# Altium schematic sheet LOGIC.SchDoc
size A4; SheetNumber: 1; SheetTotal: 2
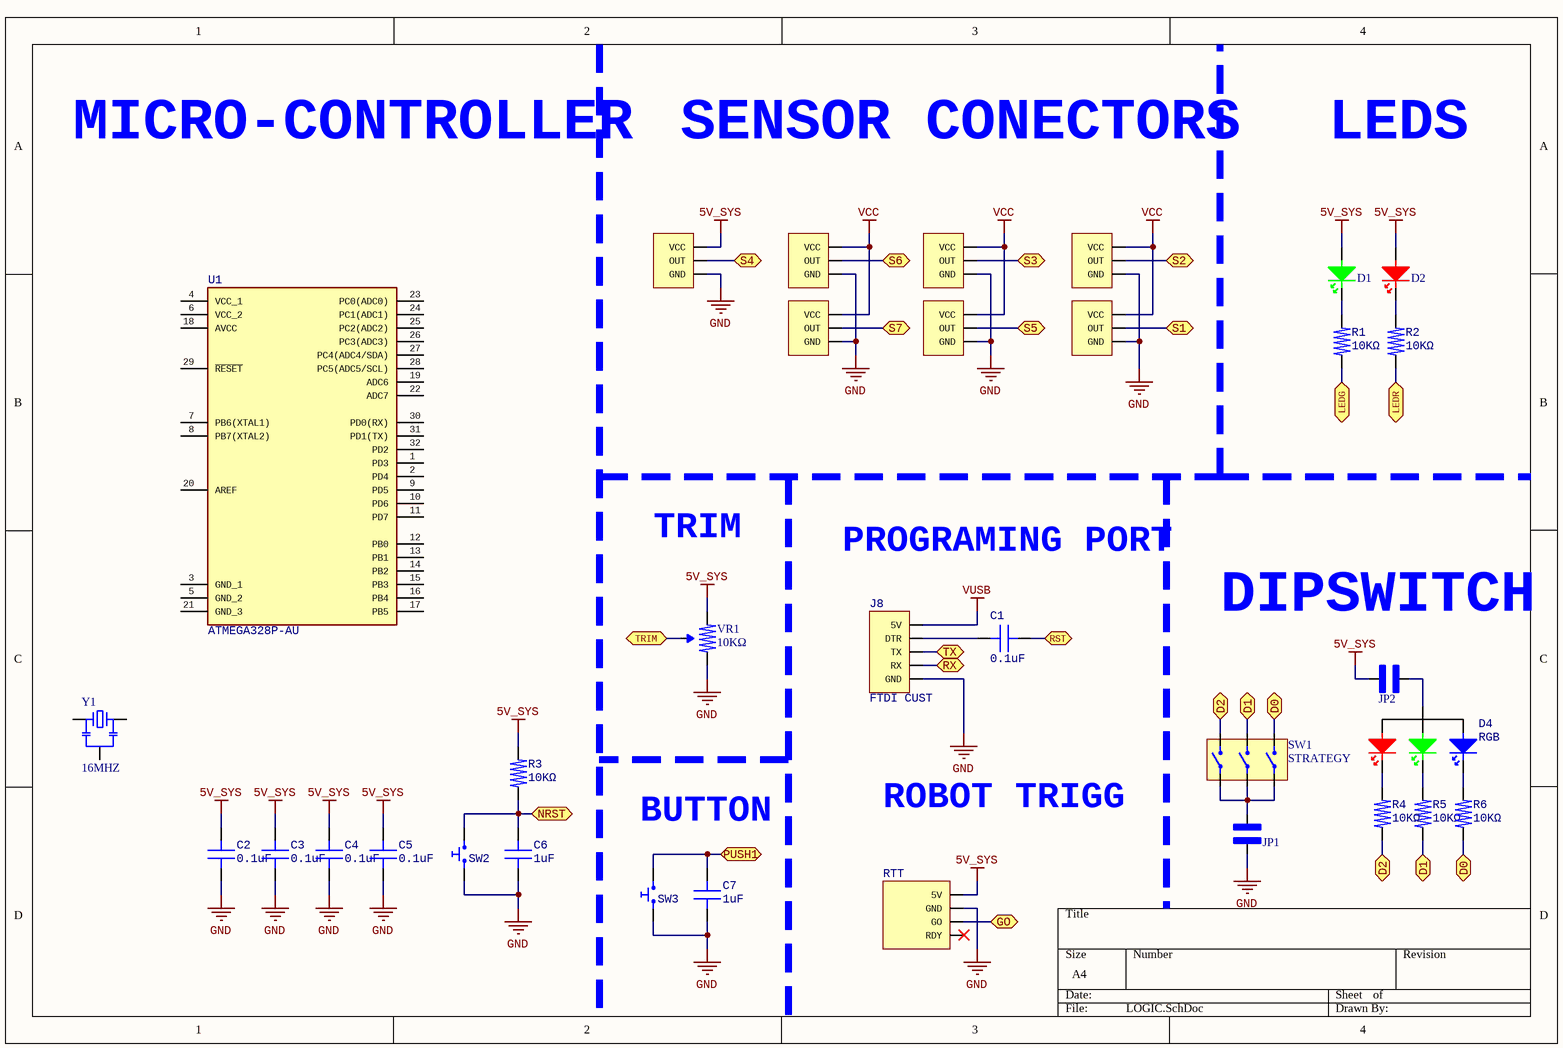
[diagram p0: LOGIC.SchDoc]

## Parts
C1  0.1uF  [CAP0603]
C2  0.1uF  [CAP0603]
C3  0.1uF  [CAP0603]
C4  0.1uF  [CAP0603]
C5  0.1uF  [CAP0603]
C6  1uF  [CAP0603]
C7  1uF  [CAP0603]
D1  G  [LED0603 GREEN]  (value not drawn)
D2  R  [LED0603 RED]  (value not drawn)
D4  RGB  [LED RGB FM-B2020RGBA-HG]
J1  GENERIC SENSOR 3X  [PINHEADER SENSOR CONNECTOR 3X]  (value not drawn)
J2  GENERIC SENSOR 3X  [PINHEADER SENSOR CONNECTOR 3X]  (value not drawn)
J3  GENERIC SENSOR 3X  [PINHEADER SENSOR CONNECTOR 3X]  (value not drawn)
J4  GENERIC SENSOR 3X  [PINHEADER SENSOR CONNECTOR 3X]  (value not drawn)
J5  GENERIC SENSOR 3X  [PINHEADER SENSOR CONNECTOR 3X]  (value not drawn)
J6  GENERIC SENSOR 3X  [PINHEADER SENSOR CONNECTOR 3X]  (value not drawn)
J7  GENERIC SENSOR 3X  [PINHEADER SENSOR CONNECTOR 3X]  (value not drawn)
J8  FTDI CUST  [UART PROG CONN]
J9  RTT  [ING. MAKER RTT]
JP1  ENABLE DPSW  [JUMPER 2 PADS]  (value not drawn)
JP2  ENABLE RGB  [JUMPER 2 PADS]  (value not drawn)
R1  10KΩ  [RES0603]
R2  10KΩ  [RES0603]
R3  10KΩ  [RES0603]
R4  10KΩ  [RES0603]
R5  10KΩ  [RES0603]
R6  10KΩ  [RES0603]
SW1  STRATEGY  [2193MSTR]
SW2  RESET  [PTS810SJK250SMTRLFS]  (value not drawn)
SW3  BUTTON1  [PTS810SJK250SMTRLFS]  (value not drawn)
U1  ATMEGA328P-AU  [TQFP-32]
VR1  10KΩ  [TC33X2503E]
Y1  16MHZ  [CSTCE16M0V53R0]

## Ports
D0 (bidir), D1 (bidir), D2 (bidir), GO (bidir), LEDG (bidir), LEDR (bidir), NRST (bidir), PUSH1 (bidir), RST (bidir), RX (bidir), S1 (bidir), S2 (bidir), S3 (bidir), S4 (bidir), S5 (bidir), S6 (bidir), S7 (bidir), TRIM (bidir), TX (bidir)

## Nets
5V_SYS: C2.2(A) C3.2(A) C4.2(A) C5.2(A) D1.2(A) D2.2(A) J1.2(VCC) J9.1(5V) JP2.C R3.2(A) VR1.3(CW)
GND: C2.1(K) C3.1(K) C4.1(K) C5.1(K) C6.1(K) C7.1(K) J1.4(GND) J2.4(GND) J3.4(GND) J4.4(GND) J5.4(GND) J6.4(GND) J7.4(GND) J8.GND J9.2(GND) JP1.C SW2.1(NO_1) SW3.1(NO_1) VR1.1(CCW)
VCC: J2.2(VCC) J3.2(VCC) J4.2(VCC) J5.2(VCC) J6.2(VCC) J7.2(VCC)
VUSB: J8.5V
D0: R6.1(K) SW1.4(NO_2) ; port D0
D1: R5.1(K) SW1.5(NO_2) ; port D1
D2: R4.1(K) SW1.6(NO_2) ; port D2
GO: J9.3(GO) ; port GO
LEDG: R1.1(K) ; port LEDG
LEDR: R2.1(K) ; port LEDR
NRST: C6.2(A) R3.1(K) SW2.2(NO_2) ; port NRST
PUSH1: C7.2(A) SW3.2(NO_2) ; port PUSH1
RST: C1.1(K) ; port RST
RX: J8.RX ; port RX
S1: J4.3(OUT) ; port S1
S2: J3.3(OUT) ; port S2
S3: J7.3(OUT) ; port S3
S4: J1.3(OUT) ; port S4
S5: J5.3(OUT) ; port S5
S6: J2.3(OUT) ; port S6
S7: J6.3(OUT) ; port S7
TRIM: VR1.2(WIPER) ; port TRIM
TX: J8.TX ; port TX
NetC1_2: C1.2(A) J8.DTR
NetD1_1: D1.1(K) R1.2(A)
NetD2_1: D2.1(K) R2.2(A)
NetD4_1: D4.1(K) R4.2(A)
NetD4_2: D4.2(K) R6.2(A)
NetD4_3: D4.3(COM) JP2.A
NetD4_4: D4.4(K) R5.2(A)
NetJP1_A: JP1.A SW1.1(NO_1) SW1.2(NO_1) SW1.3(NO_1)

Not connected (* = marked no-connect by the designer): J9 4(RDY)*; U1 1(PD3) 2(PD4) 3(GND_1) 4(VCC_1) 5(GND_2) 6(VCC_2) 7(PB6(XTAL1)) 8(PB7(XTAL2)) 9(PD5) 10(PD6) 11(PD7) 12(PB0) 13(PB1) 14(PB2) 15(PB3) 16(PB4) 17(PB5) 18(AVCC) 19(ADC6) 20(AREF) 21(GND_3) 22(ADC7) 23(PC0(ADC0)) 24(PC1(ADC1)) 25(PC2(ADC2)) 26(PC3(ADC3)) 27(PC4(ADC4/SDA)) 28(PC5(ADC5/SCL)) 29(~{RESET}) 30(PD0(RX)) 31(PD1(TX)) 32(PD2); Y1 1 3 4

## Notes on the sheet
- MICRO-CONTROLLER
- SENSOR CONECTORS
- LEDS
- TRIM
- PROGRAMING PORT
- DIPSWITCH
- BUTTON
- ROBOT TRIGG

## Library data of the parts
C1-C5 = C0.1uF 25V X7R: Capacitor, Multilayer, Ceramic, 25V, 10%, X7R, 15% Tc, 0.1Uf, Surface Mount, 0603; Manufacturer: KEMET; Manufacturer Part Number: C0603C104K3RACTU; Material: 4241ConductorMaterial; Capacitance: 100nF; Dissipation Factor: 3.5%; Temperature Coefficient: 30ppm/°C; Supplier 1: Mouser; RoHS: Yes; Category: Ceramic Capacitors; Stock 1: 364631; Pricing 1: 1=0.19, 10=0.12, 50=0.12, 100=0.062, 1000=0.041, 10000=0.024 (USD); Mount: Surface Mount,PCB; Case/Package: 0603; Number of Pins: 2; Case Code (Metric): 1608; Case Code (Imperial): 0603; Dielectric Material: Ceramic; Min Operating Temperature: -55°C; Max Operating Temperature: 125°C; Dielectric: X7R; Package Quantity: 1; Voltage Rating: 25V; Tolerance: 10%; Packaging: Tape and Reel; Voltage Rating (DC): 25V; Termination: SMD/SMT; Voltage: 25V; Series: C; Construction: Flat; Length: 1.6mm; Width: 0.031inch; Height: 0.8mm; Thickness: 0.034inch; Lead Pitch: 0.7mm; Depth: 0.8mm; Radiation Hardening: No; Reach SVHC Compliant: No; RoHS Compliant: Yes; Lead Free: 5697LeadFree
C6 C7 = C1uF 50V X5R: Multilayer Ceramic Capacitor, 1 uF, 50 V, ï¿½ 10%, X5R, 0603 [1608 Metric]; Manufacturer: TDK; Manufacturer Part Number: C1608X5R1H105K080AB; Dielectric Material: 4241ConductorMaterial; Voltage Rating: 50V; Supplier 1: Mouser; RoHS: Yes; Category: Ceramic Capacitors; Stock 1: 142150; Pricing 1: 1=0.14, 10=0.078, 50=0.078, 100=0.05, 1000=0.035, 10000=0.023 (USD); Mount: Surface Mount; Case/Package: 0603; Number of Pins: 2; Case Code (Metric): 1608; Case Code (Imperial): 0603; Material: Ceramic; Min Operating Temperature: -55°C; Max Operating Temperature: 85°C; Capacitance: 1uF; Tolerance: 10%; Packaging: Tape and Reel; Package Quantity: 1; Dielectric: X5R; Voltage: 50V; Series: C; Construction: Flat; Length: 1.6mm; Width: 0.031inch; Height: 0.8mm; Thickness: 0.035inch; Depth: 0.8mm; Reach SVHC Compliant: No; Lead Free: Lead Free; RoHS Compliant: Yes
D1 = GREEN LED 0603: WURTH ELEKTRONIK - 150060VS75000 - LED, Green, SMD, 0603, 30 mA, 2 V, 570 nm; Manufacturer: Wurth Electronics; Lens Color: Colorless; Luminous Intensity: 40mcd; Viewing Angle: 140°; Forward Voltage: 2V; Lens Style: Rectangular,Flat; Forward Current: 20mA; Dominant Wavelength: 570nm; Lens Transparency: Clear; Power Rating: 72mW; Reverse Voltage (DC): 5V; Lens Size: 0.7mm; Supplier 1: Mouser; Manufacturer Part Number: 150060VS75000; RoHS: Yes; Category: LEDs; Stock 1: 15118; Pricing 1: 1=0.14, 10=0.14, 50=0.127, 100=0.109, 1000=0.101, 10000=0.101 (USD); Mount: Surface Mount; Case/Package: 0603; Number of Pins: 2; Color: Green; Case Code (Metric): 1608; Case Code (Imperial): 0603; Weight: 0.000882oz; Min Operating Temperature: -40°C; Max Operating Temperature: 85°C; Package Quantity: 4000; Packaging: Cut Tape; Test Current: 20mA; Illumination Color: Green; Series: WL-SMCW; Max Reverse Voltage (DC): 5V; Power Dissipation: 72mW; Reverse Voltage: 5V; Length: 1.6mm; Width: 0.8mm; Height: 0.8mm; RoHS Compliant: Yes; Reach SVHC Compliant: Unknown
D2 = RED LED 0603: Led, Red, 630 Nm, 1.9 V, 30 Ma, 60 Mcd Rohs Compliant: Yes |Wurth Elektronik 150060SS75000; Manufacturer: Wurth Electronics; Lens Color: Colorless; Luminous Intensity: 60mcd; Viewing Angle: 140°; Forward Voltage: 1.9V; Wavelength: 630nm; Lens Style: Clear,Flat,Rectangular; Forward Current: 30mA; Test Current: 20mA; Lens Transparency: Clear; Max Reverse Voltage (DC): 5V; Lens Size: 0.7mm; Supplier 1: Mouser; Manufacturer Part Number: 150060SS75000; RoHS: Yes; Category: LEDs; Stock 1: 8814; Pricing 1: 1=0.15, 10=0.15, 50=0.142, 100=0.122, 1000=0.116, 10000=0.116 (USD); Mount: Surface Mount; Case/Package: 0603; Color: Red; Case Code (Metric): 1608; Case Code (Imperial): 0603; Min Operating Temperature: -40°C; Max Operating Temperature: 85°C; Package Quantity: 1; Packaging: Cut Tape; Dominant Wavelength: 630nm; Series: WL-SMCW; Length: 1.6mm; Width: 0.8mm; Height: 0.8mm; RoHS Compliant: Yes; Reach SVHC Compliant: Unknown
D4 = RGB LED FM-B2020RGBA-HG: LED RGB
J1-J7 = GENERIC SENSOR 3X: PADS PARA CONECTAR UN SENSOR CON 1 LINEA DE VOLTAJE INDEPENDIENTE.
J8 = UART PROG: GENERIC UART PROGRAMING PORT FOR ARDUINO CUSTOM BOARDS
J9 = ING. MAKER RTT: CONECTOR PINHEADER PARA ARRANCADPR ING. MAKER
JP1 JP2 = SINGLE JUMPER NO: JUMPER SMD CON 2 PADS NORMALMENTE ABIERTO; pin to pad: A>2 C>1
R1 R2 R4-R6 = R1KΩ: SMD Chip Resistor, 1 kOhm, ï¿½ 1%, 100 mW, 0603 [1608 Metric], Thick Film, General Purpose; Manufacturer: Yageo; Manufacturer Part Number: RC0603FR-101KL; Resistance: 1kR; Temperature Coefficient: 100ppm/°C; Power Rating: 100mW; Voltage Rating: 50V; Supplier 1: Mouser; RoHS: Yes; Category: Chip SMD Resistors; Stock 1: 45082; Pricing 1: 1=0.1, 10=0.01, 50=0.01, 100=0.007, 1000=0.005, 10000=0.002 (USD); Case/Package: 0603; Number of Pins: 2; Contact Plating: Tin,Lead; Case Code (Imperial): 0603; Case Code (Metric): 1608; Min Operating Temperature: -55°C; Max Operating Temperature: 155°C; Tolerance: 1%; Resistor Type: Thick Film; Packaging: Tape and Reel; Termination: SMD/SMT; Voltage Rating (DC): 50V; Series: RC; Resistance Tolerance: 1%; Length: 1.6mm; Width: 0.8mm; Height: 0.45mm; RoHS Compliant: Yes; Reach SVHC Compliant: Unknown
R3 = R10KΩ: SMD Chip Resistor, 10 kOhm, ï¿½ 5%, 100 mW, 0603 [1608 Metric], Thick Film, General Purpose; Manufacturer: Yageo; Manufacturer Part Number: RC0603JR-0710KL; Resistance: 10kR; Temperature Coefficient: 100ppm/°C; Max Power Dissipation: 100mW; Voltage Rating (AC): 50V; Supplier 1: Mouser; RoHS: Yes; Category: Chip SMD Resistors; Stock 1: 1469517; Pricing 1: 1=0.1, 10=0.008, 50=0.008, 100=0.006, 1000=0.005, 10000=0.002 (USD); Case/Package: 0603; Min Operating Temperature: -55°C; Max Operating Temperature: 155°C; Tolerance: 5%; Number of Terminations: 2; Series: RC; Lead Free: Lead Free; Reach SVHC Compliant: Unknown; RoHS Compliant: Yes
SW1 = 219-3MST: Switch DIP ON OFF SPST 3 Raised Slide 0.1A 20VDC Gull Wing 2000Cycles 2.54mm SMD Tube; Manufacturer: CTS; Voltage Rating (DC): 20V; Number of Positions: 3; Actuator Type: Slide (Standard); Current Rating: 100mA; Washable: Yes; Supplier 1: Mouser; Manufacturer Part Number: 219-3MST; RoHS: Yes; Category: DIP Switches; Stock 1: 6563; Pricing 1: 1=0.68, 10=0.509, 50=0.509, 100=0.509, 1000=0.41, 10000=0.359 (USD); Mount: Surface Mount; Contact Material: Copper; Contact Plating: Gold,Tin; Mechanical Life: 2000Cycles; Min Operating Temperature: -55°C; Max Operating Temperature: 85°C; Packaging: Rail/Tube; Throw Configuration: SPST; Max Voltage Rating (DC): 20V; Electrical Life: 2000Cycles; Series: 219; Termination: Gull Wing; Package Quantity: 60; Max Current Rating: 100mA; Orientation: Straight; Length: 9.09mm; Terminal Pitch: 2.54mm; Depth: 9.91mm; Radiation Hardening: No; RoHS Compliant: Yes; Lead Free: Lead Free; Supplier 2: Mouser; Stock 2: 6563; Pricing 2: 1=0.68, 10=0.509, 50=0.509, 100=0.509, 1000=0.41, 10000=0.359 (USD)
SW2 SW3 = PTS810SJK250SMTR LFS: Switch Tactile N.O. SPST Button J-Bend 0.05A 16VDC 50000Cycle 2.55N SMD T/R; pin to pad: 1>1+2 2>3+4; Manufacturer: ITT C&K; Mechanical Life: 50000Cycles; Operating Force: 260gf; Current Rating: 50mA; Voltage Rating (DC): 16V; Illumination Type: Non-Illuminated; Switch Travel: 0.15mm; Switch Function: Off-Mom; Number of Positions: 2; Supplier 1: Mouser; Manufacturer Part Number: PTS810SJK250SMTRLFS; RoHS: Yes; Stock 1: 28271; Pricing 1: 1=0.58, 10=0.429, 50=0.429, 100=0.353, 1000=0.313, 10000=0.231 (USD); Mount: Surface Mount; Case/Package: SMD/SMT; Color: White; Contact Plating: Silver; Min Operating Temperature: -40°C; Max Operating Temperature: 85°C; Throw Configuration: SPST; Packaging: Tape and Reel; Package Quantity: 2900; Series: PTS810; Lead Free: Lead Free; RoHS Compliant: Yes
U1 = ATMEGA328P-AU: Risc Microcontroller, 8-BIT, Flash, AVR Risc Cpu, 20MHZ, Cmos, PQFP32; Manufacturer: Microchip; Interface: I2C,SPI,USART; RAM Size: 2KB; Max Supply Voltage: 5.5V; Min Supply Voltage: 1.8V; Number of I/Os: 23; Number of Timers/Counters: 3; Number of PWM Channels: 6; Oscillator Type: Internal; Data Bus Width: 8b; Number of SPI Channels: 1; Watchdog Timer: Yes; Memory Size: 32KB; Peripherals: Brown-out Detect/Reset,POR,PWM,WDT; Number of ADC Channels: 8; Supplier 1: Mouser; Supplier 2: Mouser; Manufacturer Part Number: ATMEGA328P-AU; RoHS: Yes; Category: Microcontrollers; Stock 2: 19185; Pricing 2: 1=2.66, 10=2.66, 50=2.44, 100=2.2, 1000=2.2, 10000=2.2 (USD); Mount: Surface Mount; Case/Package: A; Number of Pins: 32; Weight: 0.002469oz; Min Operating Temperature: -40°C; Max Operating Temperature: 85°C; Packaging: Tray; Number of Programmable I/O: 23; Max Frequency: 20MHz; Number of I2C Channels: 1; Memory Type: FLASH; Core Architecture: AVR; Series: ATmega328P; Package Quantity: 250; Frequency: 20MHz; Number of A/D Converters: 1; Length: 7mm; Width: 7mm; Height: 1mm; Radiation Hardening: No; Reach SVHC Compliant: Yes; Lead Free: Lead Free; RoHS Compliant: Yes
VR1 = 10KΩ: Cermet trimmer potentiometer, 10 kΩ, 0.1 W, SMD, on top, TC33X-2-103E; Manufacturer: Bourns; Tolerance: 25%; Resistance: 10kR; Power Rating: 100mW; Number of Turns: 1; Temperature Coefficient: 250ppm/°C; Voltage Rating (DC): 50V; Supplier 1: Mouser; Manufacturer Part Number: TC33X-2-103E; RoHS: Yes; Category: Variable Resistors and Potentiometers; Stock 1: 61518; Pricing 1: 1=0.32, 10=0.23, 50=0.23, 100=0.197, 1000=0.173, 10000=0.12 (USD); Mount: Surface Mount; Color: Silver; Weight: 29.4mg; Min Operating Temperature: -40°C; Max Operating Temperature: 100°C; Packaging: Tape and Reel; Package Quantity: 1; Resistor Type: Cermet; Termination: Foot Print; Taper: Linear; Max Power Dissipation: 100mW; Series: TC33; Resistance Tolerance: 25%; Length: 3mm; Width: 0.118inch; Height: 0.047inch; Depth: 3.8mm; Radiation Hardening: No; Reach SVHC Compliant: No; Military Standard: Not; Lead Free: Lead Free; RoHS Compliant: Yes
Y1 = RESONATOR 16MHZ CSTCE16M0V53-R0: pin to pad: 4>2